# EAGLE design Blupill SCSI(i) (EAGLE 5.08)
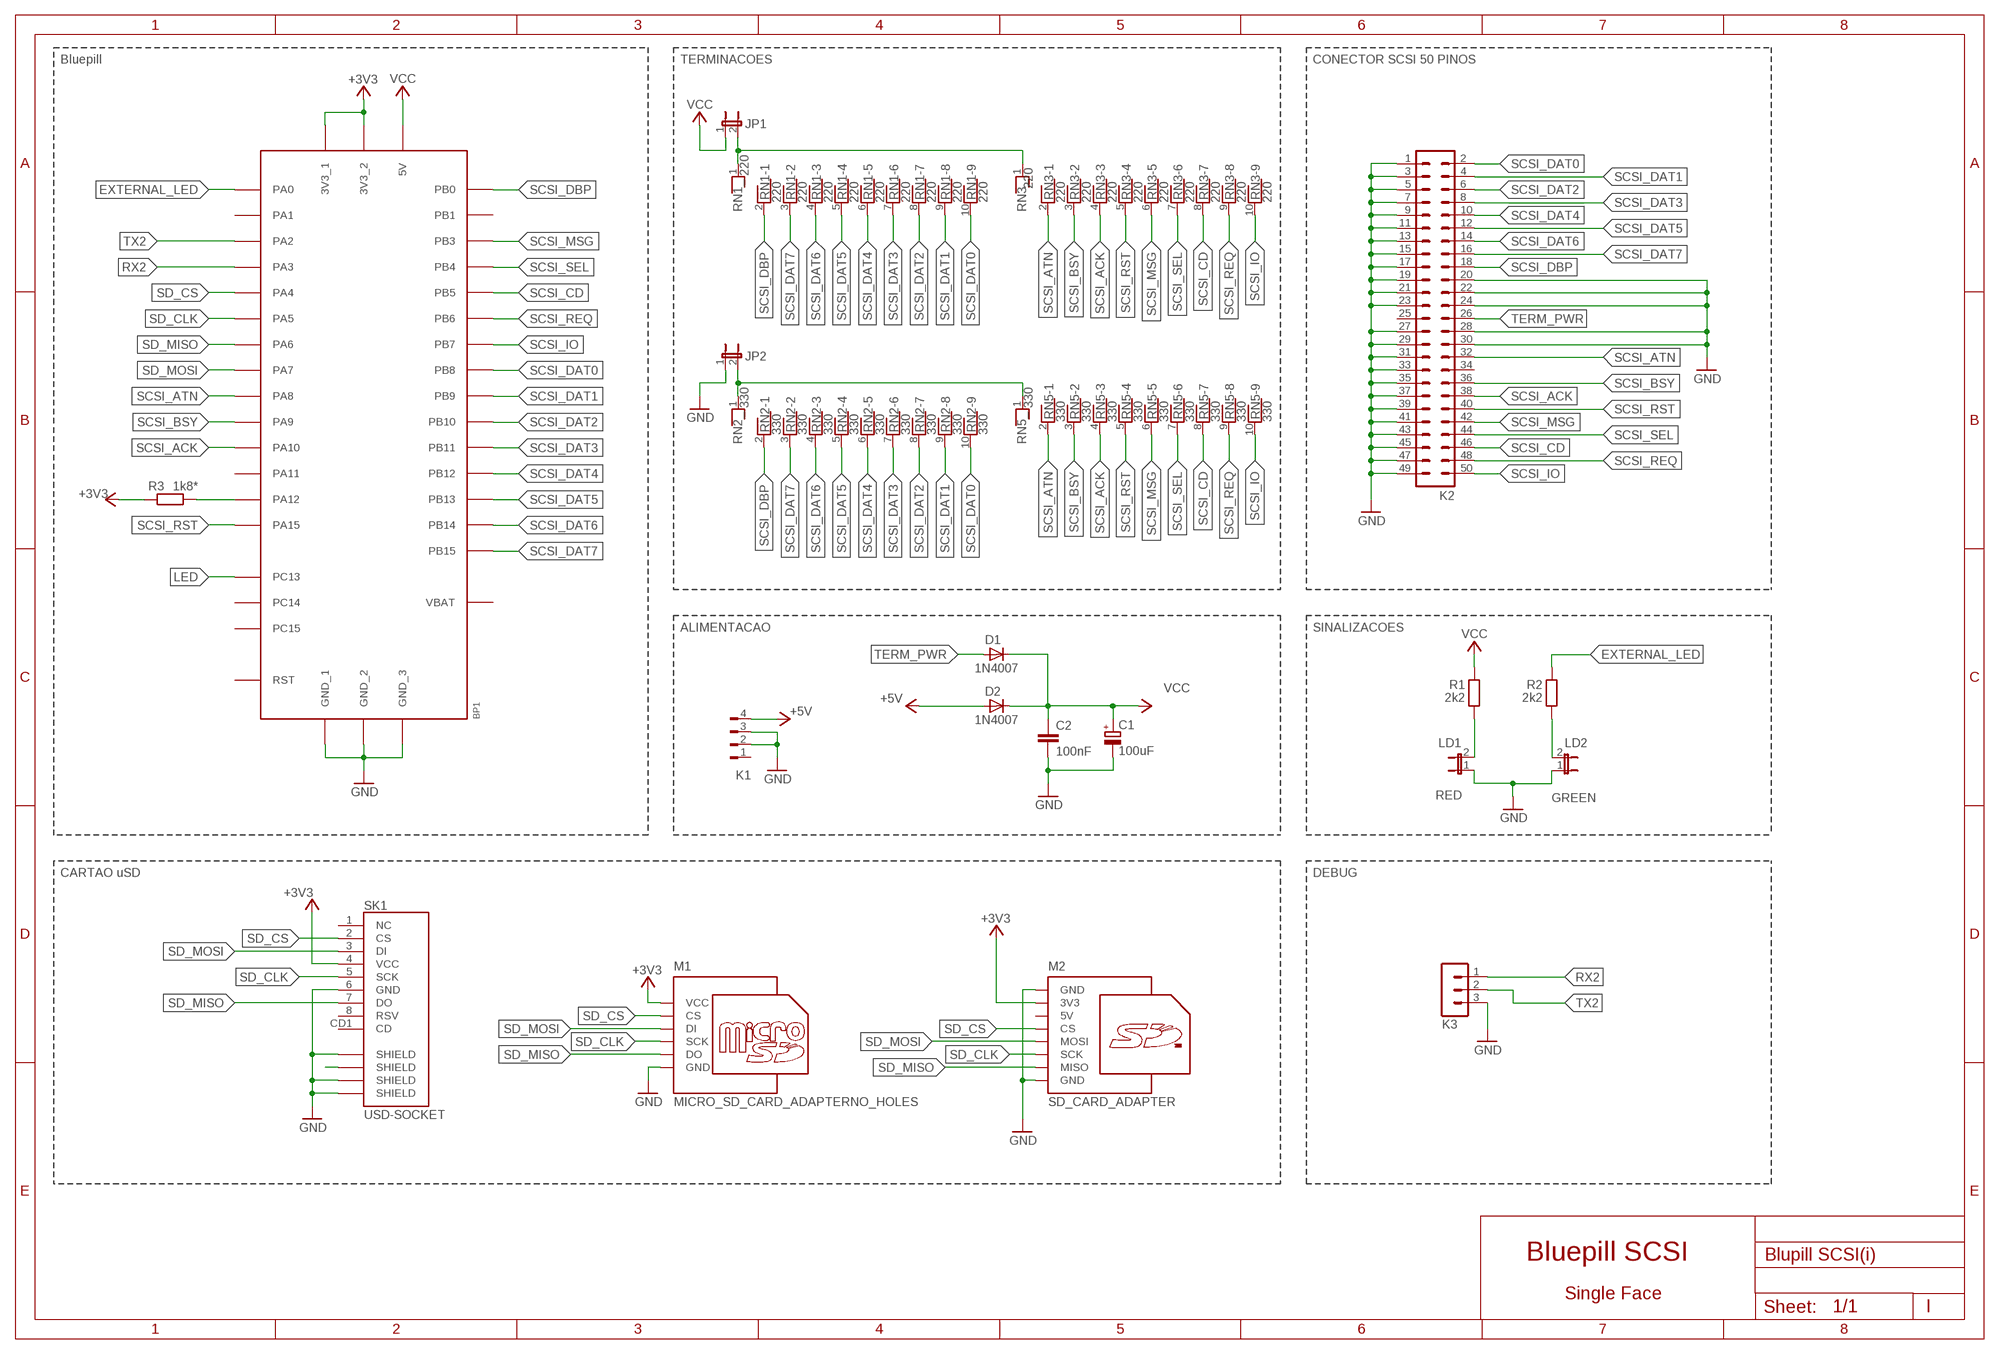
[diagram p0: schematic, sheet 1]

## Parts
BP1  BLUE_PILL_LONG  [BLUE_PILL_LONG]
C1  100uF  CPOL-EUE2.5-7  [E2,5-7]
C2  100nF  C-EU050-025X075  [C050-025X075]
D1  1N4007  1N4004  [DIODE_DO41-10]
D2  1N4007  1N4004  [DIODE_DO41-10]
JP1  JP1E  [JP1]
JP2  JP1E  [JP1]
K1  FLOP-4W827001  [827001]
K2  CON-HARTING-ML_ML50L_LONG  [HARTING-ML_ML50L_LONG]
K3  MA03-1  [MA03-1]
LD1  RED  JP1E  [JP1]
LD2  GREEN  JP1E  [JP1]
M1  MICRO_SD_CARD_ADAPTERNO_HOLES  [MICRO_SD-ADAPTER_NOHOLES]
M2  SD_CARD_ADAPTER  [SD/MMCADAPTER]
R1  2k2  R300_THT  [RCL_0204/7]
R2  2k2  R300_THT  [RCL_0204/7]
R3  1k8*  R300_THT  [RCL_0204/7]
RN1  220  RNX9  [RN-10]
RN2  330  RNX9  [RN-10]
RN3  220  RNX9  [RN-10]
RN5  330  RNX9  [RN-10]
SK1  USD-SOCKET  [USD-SOCKET-PP]

## Nets
+3V3: BP1.3,3V_1(3V3_1) BP1.3,3V_2(3V3_2) M1.P$1(VCC) M2.P$3(3V3) R3.1 SK1.4(VCC)
+5V: D2.A K1.4
EXTERNAL_LED: BP1.A0 R2.2
GND: BP1.GND1(GND_1) BP1.GND2(GND_2) BP1.GND3(GND_3) C1.- C2.2 JP2.1 K1.2 K1.3 K2.1 K2.3 K2.5 K2.7 K2.9 K2.11 K2.13 K2.15 K2.17 K2.19 K2.20 K2.21 K2.22 K2.23 K2.24 K2.27 K2.28 K2.29 K2.30 K2.31 K2.33 K2.35 K2.37 K2.39 K2.41 K2.43 K2.45 K2.47 K2.49 K3.3 LD1.1 LD2.1 M1.P$6(GND) M2.P$1(GND) M2.P$15(GND) SK1.6(GND) SK1.GND1(SHIELD) SK1.GND2(SHIELD) SK1.GND3(SHIELD)
LED: BP1.C13
N$1: JP2.2 RN2.1 RN5.1
N$2: LD1.2 R1.1
N$3: LD2.2 R2.1
N$4: JP1.2 RN1.1 RN3.1
N$5: BP1.A12 R3.2
RX2: BP1.A3 K3.1
SCSI_ACK: BP1.A10 K2.38 RN3.4 RN5.4
SCSI_ATN: BP1.A8 K2.32 RN3.2 RN5.2
SCSI_BSY: BP1.A9 K2.36 RN3.3 RN5.3
SCSI_CD: BP1.B5 K2.46 RN3.8 RN5.8
SCSI_DAT0: BP1.B8 K2.2 RN1.10 RN2.10
SCSI_DAT1: BP1.B9 K2.4 RN1.9 RN2.9
SCSI_DAT2: BP1.B10 K2.6 RN1.8 RN2.8
SCSI_DAT3: BP1.B11 K2.8 RN1.7 RN2.7
SCSI_DAT4: BP1.B12 K2.10 RN1.6 RN2.6
SCSI_DAT5: BP1.B13 K2.12 RN1.5 RN2.5
SCSI_DAT6: BP1.B14 K2.14 RN1.4 RN2.4
SCSI_DAT7: BP1.B15 K2.16 RN1.3 RN2.3
SCSI_DBP: BP1.B0 K2.18 RN1.2 RN2.2
SCSI_IO: BP1.B7 K2.50 RN3.10 RN5.10
SCSI_MSG: BP1.B3 K2.42 RN3.6 RN5.6
SCSI_REQ: BP1.B6 K2.48 RN3.9 RN5.9
SCSI_RST: BP1.A15 K2.40 RN3.5 RN5.5
SCSI_SEL: BP1.B4 K2.44 RN3.7 RN5.7
SD_CLK: BP1.A5 M1.P$4(SCK) M2.P$11(SCK) SK1.5(SCK)
SD_CS: BP1.A4 M1.P$2(CS) M2.P$7(CS) SK1.2(CS)
SD_MISO: BP1.A6 M1.P$5(DO) M2.P$13(MISO) SK1.7(DO)
SD_MOSI: BP1.A7 M1.P$3(DI) M2.P$9(MOSI) SK1.3(DI)
SH_FLOAT: SK1.GND4(SHIELD)
TERM_PWR: D1.A K2.26
TX2: BP1.A2 K3.2
VCC: BP1.5V C1.+ C2.1 D1.C D2.C JP1.1 R1.2
Unconnected: BP1.A1 BP1.A11 BP1.B1 BP1.C14 BP1.C15 BP1.RST K1.1 K2.25 K2.34 M2.P$5(5V) SK1.1(NC) SK1.8(RSV) SK1.CD1(CD)

## Notes on the sheet
- Bluepill | TERMINACOES | CONECTOR SCSI 50 PINOS
- ALIMENTACAO | SINALIZACOES
- CARTAO uSD | DEBUG
- Bluepill SCSI
- Single Face
- I

## Power pins joined to a net without a drawn wire
VBAT: BP1.VB(VBAT)

## Library data of the parts
BP1 = sd_adapters:BLUE_PILL: Módulo de desenvolvimento Blue Pill.
C1 = rcl:CPOL-EU: POLARIZED CAPACITOR, European symbol
C2 = rcl:C-EU: CAPACITOR, European symbol
D1 D2 = sd_adapters:1N4004
JP1 JP2 LD1 LD2 = jumper:JP1E: JUMPER
K1 = con-amp:FLOP-4W: MATE N-LOCK Floppy / HDD conector Distributor: Bürklin 71F972
K2 = sd_adapters:CON-HARTING-ML_ML50: HARTING
K3 = con-lstb:MA03-1: PIN HEADER
M1 = sd_adapters:MICRO_SD_CARD_ADAPTER
M2 = sd_adapters:SD_CARD_ADAPTER
R1-R3 = sd_adapters:R300_THT
RN1-RN3 RN5 = resistor-net:RNX9: RESISTOR NETWORK
SK1 = sd_adapters:USD-SOCKET: Footprint do soquete para cartão uSD.

## Board
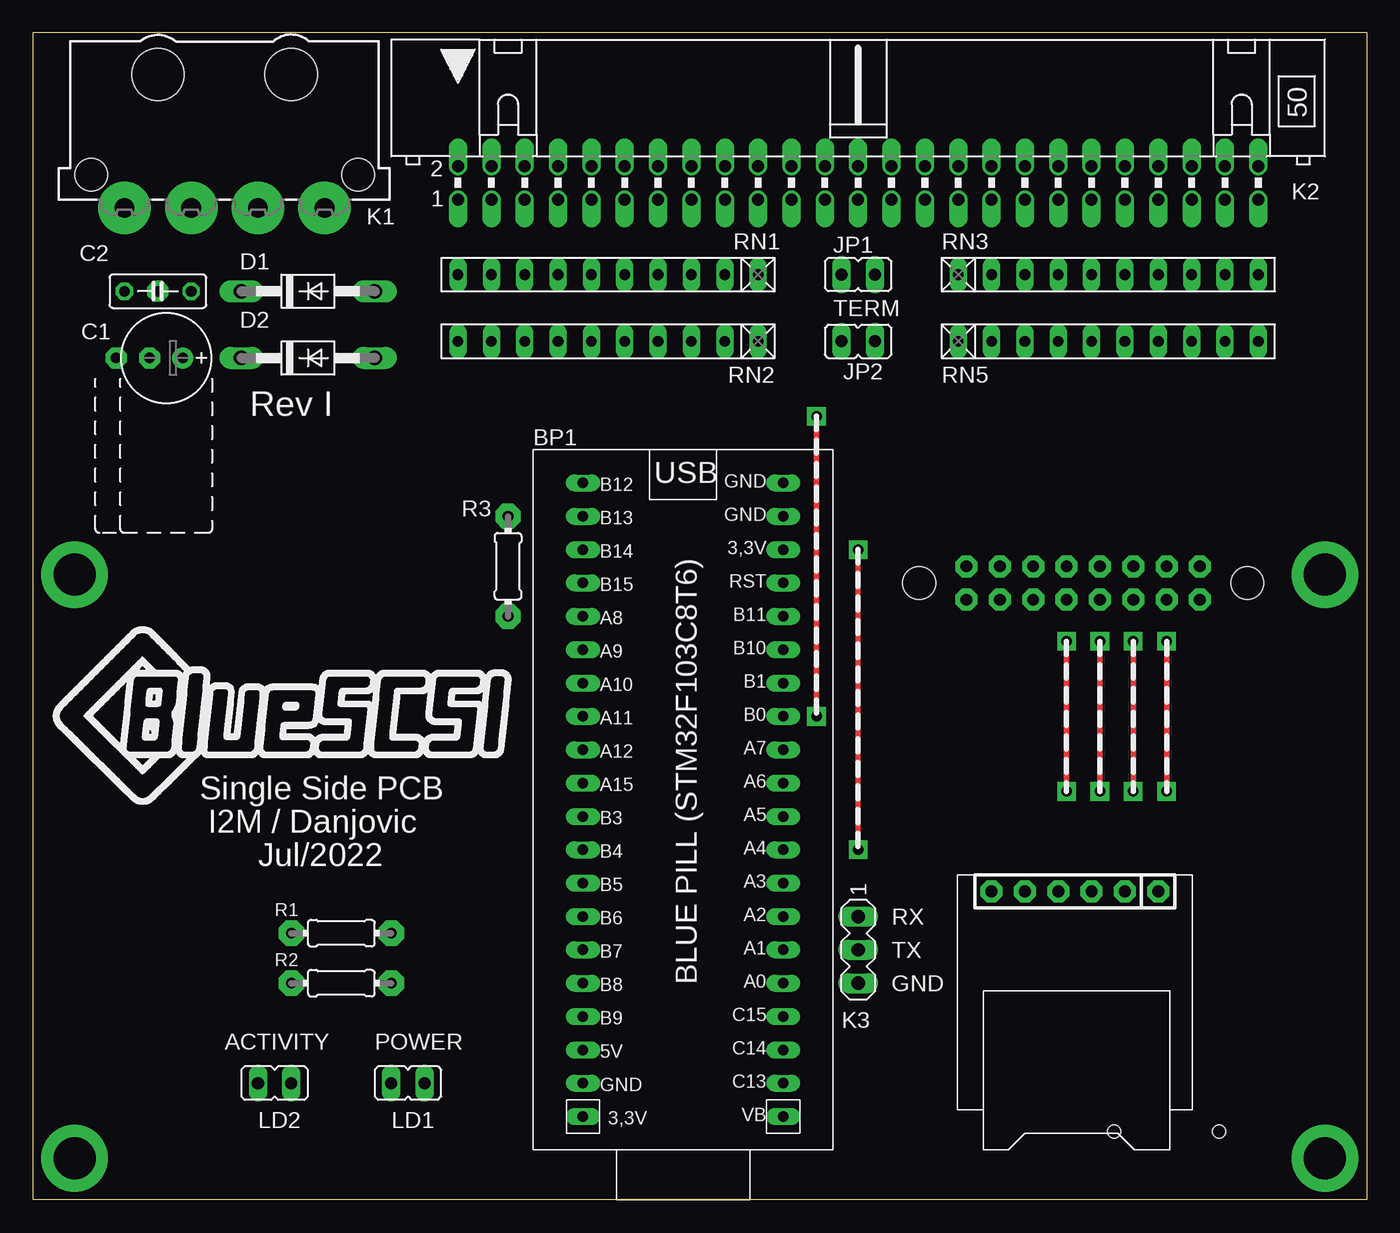
[diagram p1: board, top side]
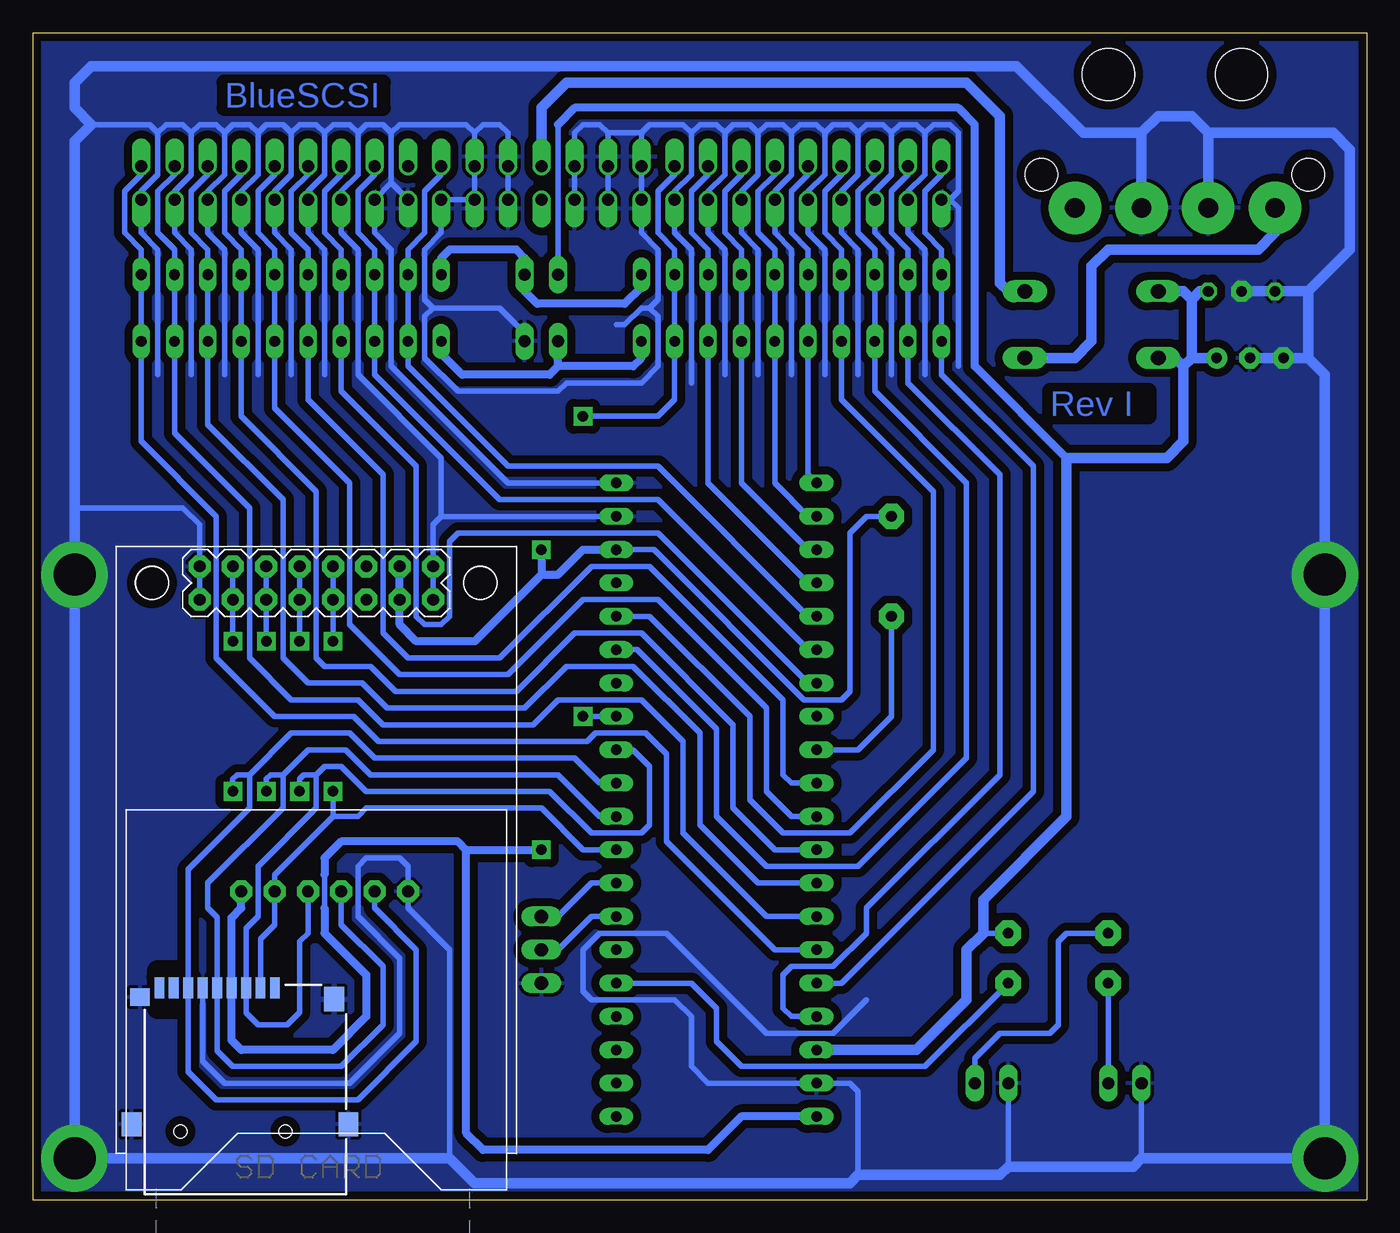
[diagram p2: board, bottom side, seen from below]

Size 101.6 x 88.9 mm. Coordinates in mm from the lower left corner, seen from the top.
Outline: 101.6,88.9 101.6,0 0,0 0,88.9 101.6,88.9
Copper layers (1*16): Top 0.035mm / dielectric 1.5mm / Bottom 0.035mm
Design rules "default *": minimum track width 16mil, minimum drill 24mil, track to track 8mil, track to pad 8mil, pad to pad 8mil, via to via 8mil, smd to smd 8mil, copper to edge 25mil, drill to drill 8mil, minimum pad ring 10mil, minimum via ring 8mil, stop-mask expansion 4mil, vias tented up to drill 0mil, thermal gap 10mil
bRestrict: 2 lines

### Footprints (pad centres in the part's own frame; a part is rotated, then mirrored left to right if it is on the bottom)
BLUE_PILL_LONG = drill 0.8 long: 3,3V_1 -19.05,7.62; 3,3V_2 24.13,-7.62; 5V 19.05,-7.62; A0 13.97,7.62; A1 11.43,7.62; A2 8.89,7.62; A3 6.35,7.62; A4 3.81,7.62; A5 1.27,7.62; A6 -1.27,7.62; A7 -3.81,7.62; A8 -13.97,-7.62; A9 -11.43,-7.62; A10 -8.89,-7.62; A11 -6.35,-7.62; A12 -3.81,-7.62; A15 -1.27,-7.62; B0 -6.35,7.62; B1 -8.89,7.62; B3 1.27,-7.62; B4 3.81,-7.62; B5 6.35,-7.62; B6 8.89,-7.62; B7 11.43,-7.62; B8 13.97,-7.62; B9 16.51,-7.62; B10 -11.43,7.62; B11 -13.97,7.62; B12 -24.13,-7.62; B13 -21.59,-7.62; B14 -19.05,-7.62; B15 -16.51,-7.62; C13 21.59,7.62; C14 19.05,7.62; C15 16.51,7.62; GND1 -24.13,7.62; GND2 -21.59,7.62; GND3 21.59,-7.62; RST -16.51,7.62; VB 24.13,7.62
E2,5-7 = drill 0.813 pad 1.6 round: + -1.27,0 | drill 0.813 pad 1.6 octagon: - 1.27,0
C050-025X075 = drill 0.813 octagon: 1 -2.54,0; 2 2.54,0
DIODE_DO41-10 = drill 1.118 long: A 5.08,0; C -5.08,0
JP1 = drill 0.914 long: 1 0,-1.27; 2 0,1.27
827001 = drill 1.5 pad 4 round: 1 -7.62,0; 2 -2.54,0; 3 2.54,0; 4 7.62,0 | hole 4: 5.08,-10.16; -5.08,-10.16 | hole 2.5: 10.16,-2.54; -10.16,-2.54
HARTING-ML_ML50L_LONG = drill 0.914 offset: 1 -30.48,-1.27; 2 -30.48,1.27; 3 -27.94,-1.27; 4 -27.94,1.27; 5 -25.4,-1.27; 6 -25.4,1.27; 7 -22.86,-1.27; 8 -22.86,1.27; 9 -20.32,-1.27; 10 -20.32,1.27; 11 -17.78,-1.27; 12 -17.78,1.27; 13 -15.24,-1.27; 14 -15.24,1.27; 15 -12.7,-1.27; 16 -12.7,1.27; 17 -10.16,-1.27; 18 -10.16,1.27; 19 -7.62,-1.27; 20 -7.62,1.27; 21 -5.08,-1.27; 22 -5.08,1.27; 23 -2.54,-1.27; 24 -2.54,1.27; 25 0,-1.27; 26 0,1.27; 27 2.54,-1.27; 28 2.54,1.27; 29 5.08,-1.27; 30 5.08,1.27; 31 7.62,-1.27; 32 7.62,1.27; 33 10.16,-1.27; 34 10.16,1.27; 35 12.7,-1.27; 36 12.7,1.27; 37 15.24,-1.27; 38 15.24,1.27; 39 17.78,-1.27; 40 17.78,1.27; 41 20.32,-1.27; 42 20.32,1.27; 43 22.86,-1.27; 44 22.86,1.27; 45 25.4,-1.27; 46 25.4,1.27; 47 27.94,-1.27; 48 27.94,1.27; 49 30.48,-1.27; 50 30.48,1.27
MA03-1 = drill 1.016 long: 1 -2.54,0; 2 0,0; 3 2.54,0
MICRO_SD-ADAPTER_NOHOLES = drill 0.9 pad 1.676 octagon: P$1 0,6.35; P$2 0,3.81; P$3 0,1.27; P$4 0,-1.27; P$5 0,-3.81; P$6 0,-6.35
SD/MMCADAPTER = drill 0.9 pad 1.676 octagon: P$1 -1.27,8.89; P$2 1.27,8.89; P$3 -1.27,6.35; P$4 1.27,6.35; P$5 -1.27,3.81; P$6 1.27,3.81; P$7 -1.27,1.27; P$8 1.27,1.27; P$9 -1.27,-1.27; P$10 1.27,-1.27; P$11 -1.27,-3.81; P$12 1.27,-3.81; P$13 -1.27,-6.35; P$14 1.27,-6.35; P$15 -1.27,-8.89; P$16 1.27,-8.89 | hole 2.5: 0,12.5; 0,-12.5
RCL_0204/7 = drill 0.813 pad 1.93 octagon: 1 -3.81,0; 2 3.81,0
RN-10 = drill 0.813 long: 1 -11.43,0; 2 -8.89,0; 3 -6.35,0; 4 -3.81,0; 5 -1.27,0; 6 1.27,0; 7 3.81,0; 8 6.35,0; 9 8.89,0; 10 11.43,0
USD-SOCKET-PP = smd 0.75 x 1.6: 1 1.93,7.91; 2 0.83,7.91; 3 -0.27,7.91; 4 -1.37,7.91; 5 -2.47,7.91; 6 -3.57,7.91; 7 -4.67,7.91; 8 -5.77,7.91; CD1 -6.87,7.91 | smd 1.5 x 1.35: GND1 -8.339,7.19 | smd 1.5 x 1.858: GND2 -8.974,-2.494; GND3 7.534,-2.494; GND4 6.434,7.04 | hole 1: 2.73,-3.04; -5.27,-3.04

### Placement (x,y rotation side)
BP1  49.53,30.48 270 top
C1  10.16,64.14 180 top
C2  9.52,69.22 180 top
D1  20.96,69.22 0 top
D2  20.96,64.14 0 top
JP1  62.86,70.48 270 top
JP2  62.86,65.41 90 top
K1  14.61,75.56 180 top
K2  62.86,77.47 0 top
K3  62.86,19.05 270 top
LD1  28.57,8.89 270 top
LD2  18.41,8.89 270 top
M1  79.38,23.5 270 top
M2  80.01,46.99 270 bottom
R1  23.5,20.32 0 top
R2  23.5,16.51 0 top
R3  36.2,48.26 270 top
RN1  43.81,70.48 180 top
RN2  43.81,65.41 180 top
RN3  81.91,70.48 0 top
RN5  81.91,65.41 0 top
SK1  85.09,8.25 0 bottom

### Tracks (layer width: path | path; a pad name or v marks a point on that pad's centre or on a via)
+3V3  (via drill 0.8 pad 1.42)
  Top 0.406: v62.86,26.67 v62.86,49.53
  Bottom 0.406: BP1.3,3V_1 54.29,49.53 42.86,38.1 40,38.1 39.37,38.73 39.37,50.8 38.1,52.07 R3.1 | 79.38,24.77 79.38,22.23
  Bottom 0.61: BP1.3,3V_2 47.62,6.35 50.16,3.81 67.31,3.81 68.58,5.08 68.58,26.67 | BP1.3,3V_1 59.69,49.53 61.59,47.62 62.86,47.62 | v62.86,49.53 62.86,47.62 | 62.86,47.62 67.94,42.54 72.39,42.54 73.66,43.81 M2.P$3 | M1.P$1 85.72,22.23 86.46,21.49 SK1.4 86.46,12.16 85.72,11.43 78.74,11.43 76.2,13.97 76.2,17.14 79.38,20.32 79.38,22.23 | 79.38,24.77 79.38,26.04 78.11,27.3 69.22,27.3 68.58,26.67 | 68.58,26.67 v62.86,26.67
+5V
  Bottom 0.813: D2.A 22.23,64.14 20.96,65.41 20.96,71.12 19.69,72.39 8.25,72.39 6.98,73.66 K1.4
EXTERNAL_LED
  Bottom 0.406: BP1.A0 51.43,16.51 49.53,14.61 49.53,12.07 47.62,10.16 33.66,10.16 R2.2
GND  (via drill 0.8 pad 1.6, 3.2 pad 5.08)
  Bottom 0.406: 92.08,81.28 92.08,78.11 93.34,76.83 K2.49 93.34,73.66 92.08,72.39 92.08,62.86 | 89.53,81.28 89.53,78.11 90.8,76.83 K2.47 90.8,73.66 89.53,72.39 89.53,62.86 | 86.99,81.28 86.99,78.11 88.27,76.83 K2.45 88.27,73.66 86.99,72.39 86.99,62.86 | 84.45,81.28 84.45,78.11 85.72,76.83 K2.43 85.72,73.66 84.45,72.39 84.45,62.86 | 81.91,81.28 81.91,78.11 83.19,76.83 K2.41 83.19,73.66 81.91,72.39 81.91,62.86 | 79.38,81.28 79.38,78.11 80.64,76.83 K2.39 80.64,73.66 79.38,72.39 79.38,62.86 | 76.83,81.28 76.83,78.11 78.11,76.83 K2.37 78.11,73.66 76.83,72.39 76.83,62.86 70.48,56.52 70.48,52.07 | 74.3,77.47 K2.35 75.56,73.66 74.3,72.39 74.3,63.5 65.41,54.61 BP1.GND1 | 74.3,81.28 74.3,77.47 | 74.3,77.47 K2.33 | K2.23 K2.24 60.32,81.28 59.69,81.91 58.42,81.91 57.78,81.28 | K2.21 K2.22 57.78,81.28 | K2.27 K2.28 65.41,81.28 66.04,81.91 67.31,81.91 67.94,81.28 | 67.94,81.28 K2.30 K2.29 K2.31 70.48,73.66 71.75,72.39 71.75,68.58 71.12,67.94 | 55.24,81.28 57.78,81.28 | 55.24,81.28 54.61,81.91 52.07,81.91 51.43,81.28 | 51.43,81.28 50.8,81.91 49.53,81.91 48.89,81.28 | 48.89,81.28 48.26,81.91 46.99,81.91 46.35,81.28 | 55.24,81.28 K2.20 K2.19 55.24,73.66 53.97,72.39 53.97,68.58 54.61,67.94 | 51.43,81.28 51.43,78.11 52.7,76.83 K2.17 52.7,73.66 51.43,72.39 51.43,62.23 | 48.89,81.28 48.89,78.11 50.16,76.83 K2.15 50.16,73.66 48.89,72.39 48.89,62.86 | 46.35,81.28 46.35,78.11 47.62,76.83 K2.13 47.62,73.66 46.35,72.39 46.35,62.86 | 43.81,81.28 43.81,78.11 45.08,76.83 K2.11 45.08,73.66 43.81,72.39 43.81,62.86 | 46.35,81.28 45.72,81.91 44.45,81.91 43.81,81.28 | 41.27,81.28 41.27,78.11 42.54,76.83 K2.9 42.54,73.66 41.27,72.39 41.27,62.86
  Bottom 0.406: 41.27,81.28 41.91,81.91 43.18,81.91 43.81,81.28 | 38.73,81.28 38.73,78.11 40,76.83 K2.7 40,73.66 38.73,72.39 38.73,62.86 | 41.27,81.28 40.64,81.91 39.37,81.91 38.73,81.28 | 36.2,81.28 36.2,78.11 37.46,76.83 K2.5 37.46,73.66 36.2,72.39 36.2,62.86 | 36.2,81.28 36.83,81.91 38.1,81.91 38.73,81.28 | 33.66,81.28 33.66,78.11 34.92,76.83 K2.3 34.92,73.66 33.66,72.39 33.66,62.86 | 36.2,81.28 35.56,81.91 34.29,81.91 33.66,81.28 | 31.75,76.2 K2.1 | 31.75,76.2 31.12,76.83 31.12,81.28 31.75,81.91 33.02,81.91 33.66,81.28 | 38.73,1.9 38.73,8.25 39.37,8.89 BP1.GND3 50.16,8.89 51.43,10.16 51.43,13.97 52.7,15.24 59.05,15.24 59.69,15.88 59.69,19.05 58.42,20.32 53.34,20.32 45.72,12.7 40.64,12.7 38.1,15.24 | 31.75,76.2 31.12,75.56 31.12,63.5 | 74.3,81.28 73.66,81.91 68.58,81.91 67.94,81.28 | 74.3,81.28 74.93,81.91 76.2,81.91 76.83,81.28 | 79.38,81.28 78.74,81.91 77.47,81.91 76.83,81.28 | 79.38,81.28 80.01,81.91 81.28,81.91 81.91,81.28 | 84.45,81.28 83.82,81.91 82.55,81.91 81.91,81.28 | 84.45,81.28 85.09,81.91 86.36,81.91 86.99,81.28 | 89.53,81.28 88.9,81.91 87.63,81.91 86.99,81.28 | 89.53,81.28 90.17,81.91 91.44,81.91 92.08,81.28 | 17.14,3.17 LD2.1 | 27.3,2.54 LD1.1 | 70.48,52.07 BP1.GND2 | 54.61,67.94 53.97,67.31 53.97,63.5 55.24,62.23 60.96,62.23 61.59,61.59 69.22,61.59 71.75,64.14 71.75,67.31 71.12,67.94 | 71.12,67.94 66.04,67.94 64.14,66.04 JP2.1 | 54.61,67.94 55.24,67.94 56.52,66.67 57.15,66.67 | 97.16,81.91 92.71,81.91 92.08,81.28 | 70.48,52.07 71.12,51.43 M2.P$1 71.12,45.72 | 98.42,52.7 90.17,52.7 88.9,51.43 M2.P$15 88.9,45.72 | 69.85,3.17 69.85,19.05 73.02,22.23 M1.P$6 73.02,25.4 73.66,26.04 76.2,26.04 76.83,25.4 76.83,21.59 73.66,18.41 73.66,12.7 77.47,8.89 86.99,8.89 88.66,10.55 SK1.6
  Bottom 0.813: 4.45,69.22 1.27,72.39 1.27,80.01 2.54,81.28 12.07,81.28 | 4.45,69.22 C2.2 v9.52,69.22 | C1.- v6.35,64.14 4.45,64.14 | 4.45,64.14 4.45,69.22 | 4.45,64.14 3.17,62.86 v3.17,47.62 v3.17,3.17 17.14,3.17 17.78,2.54 27.3,2.54 27.94,1.9 38.73,1.9 39.37,1.27 67.94,1.27 69.85,3.17 v98.42,3.17 v98.42,47.62 98.42,52.7 98.42,80.64 97.16,81.91 98.42,83.19 98.42,85.09 97.16,86.36 26.67,86.36 21.59,81.28 17.14,81.28 | 17.14,81.28 15.88,82.55 13.34,82.55 12.07,81.28 | 12.07,81.28 K1.3 | 17.14,81.28 K1.2
  pour Bottom (isolate 0.61): 101.6,0 0,0 0,88.9 101.6,88.9
N$1
  Bottom 0.61: RN5.1 70.48,64.45 68.9,62.86 62.23,62.86 61.59,63.5 | 61.59,63.5 55.88,63.5 55.24,64.14 RN2.1 | 61.59,63.5 JP2.2
N$2
  Bottom 0.406: LD1.2 29.85,10.79 27.94,12.7 24.13,12.7 23.5,13.34 23.5,19.69 22.86,20.32 R1.1
N$3
  Bottom 0.406: LD2.2 R2.1
N$4
  Bottom 0.61: RN3.1 70.48,71.75 69.85,72.39 64.77,72.39 64.14,71.75 JP1.2 64.14,69.22 63.18,68.26 56.52,68.26 55.24,69.53 RN1.1
N$5
  Bottom 0.406: BP1.A12 38.73,34.29 36.2,36.83 R3.2
RX2
  Bottom 0.406: BP1.A3 59.05,24.13 61.59,21.59 K3.1
SCSI_ACK
  Bottom 0.406: K2.38 78.11,78.11 79.38,76.83 79.38,73.66 78.11,72.39 RN3.4 RN5.4 78.11,61.59 72.39,55.88 72.39,44.45 71.75,43.81 70.48,43.81 69.85,44.45 69.85,50.16 69.22,50.8 53.97,50.8 42.54,39.37 BP1.A10
SCSI_ATN
  Bottom 0.406: BP1.A8 42.54,44.45 53.97,55.88 65.41,55.88 73.02,63.5 RN5.2 RN3.2 73.02,72.39 71.75,73.66 71.75,76.83 70.48,78.11 K2.32
SCSI_BSY
  Bottom 0.406: BP1.A9 42.54,41.91 53.97,53.34 66.04,53.34 75.56,62.86 RN5.3 RN3.3 75.56,72.39 76.83,73.66 76.83,76.83 75.56,78.11 K2.36
SCSI_CD
  Bottom 0.406: BP1.B5 46.35,24.13 50.8,28.57 50.8,35.56 55.88,40.64 60.96,40.64 64.14,37.46 74.61,37.46 76.52,39.37 80.64,39.37 82.55,41.27 82.55,53.34 88.27,59.05 RN5.8 RN3.8 88.27,72.39 89.53,73.66 89.53,76.83 88.27,78.11 K2.46
SCSI_DAT0
  Bottom 0.406: BP1.B8 40,16.51 25.4,31.12 25.4,55.88 32.38,62.86 RN2.10 RN1.10 32.38,72.39 33.66,73.66 33.66,76.83 32.38,78.11 K2.2
SCSI_DAT1
  Bottom 0.406: BP1.B9 43.81,13.97 44.45,14.61 44.45,17.14 43.81,17.78 40.64,17.78 38.1,20.32 38.1,22.23 27.94,32.38 27.94,55.24 34.92,62.23 RN2.9 RN1.9 34.92,72.39 36.2,73.66 36.2,76.83 34.92,78.11 K2.4
SCSI_DAT2
  Bottom 0.406: BP1.B10 55.56,41.91 49.53,35.88 49.53,29.21 45.72,25.4 38.73,25.4 30.48,33.66 30.48,54.61 37.46,61.59 RN2.8 RN1.8 37.46,72.39 38.73,73.66 38.73,76.83 37.46,78.11 K2.6
SCSI_DAT3
  Bottom 0.406: K2.8 40,78.11 41.27,76.83 41.27,73.66 40,72.39 RN1.7 RN2.7 40,60.96 33.02,53.97 33.02,34.29 39.37,27.94 44.45,27.94 46.99,30.48 46.99,36.83 54.61,44.45 BP1.B11
SCSI_DAT4
  Bottom 0.406: BP1.B12 42.54,55.24 RN2.6 RN1.6 42.54,72.39 43.81,73.66 43.81,76.83 42.54,78.11 K2.10
SCSI_DAT5
  Bottom 0.406: BP1.B13 42.54,52.07 45.08,54.61 RN2.5 RN1.5 45.08,72.39 46.35,73.66 46.35,76.83 45.08,78.11 K2.12
SCSI_DAT6
  Bottom 0.406: BP1.B14 42.54,49.53 47.62,54.61 RN2.4 RN1.4 47.62,72.39 48.89,73.66 48.89,76.83 47.62,78.11 K2.14
SCSI_DAT7
  Bottom 0.406: BP1.B15 42.54,46.99 50.16,54.61 RN2.3 RN1.3 50.16,72.39 51.43,73.66 51.43,76.83 50.16,78.11 K2.16
SCSI_DBP  (via drill 0.8 pad 1.42)
  Top 0.406: v59.69,36.83 v59.69,59.69
  Bottom 0.406: BP1.B0 v59.69,36.83 | K2.18 52.7,78.11 53.97,76.83 53.97,73.66 52.7,72.39 RN1.2 RN2.2 52.7,60.96 53.97,59.69 v59.69,59.69
SCSI_IO
  Bottom 0.406: BP1.B7 45.08,19.05 53.34,27.3 53.34,33.97 54.93,35.56 58.74,35.56 59.37,34.92 75.25,34.92 77.15,36.83 83.19,36.83 87.63,41.27 87.63,52.07 93.34,57.78 RN5.10 RN3.10 93.34,72.39 94.61,73.66 94.61,76.83 93.34,78.11 K2.50
SCSI_MSG
  Bottom 0.406: BP1.B3 43.81,29.21 45.72,31.12 45.72,37.46 53.97,45.72 59.69,45.72 65.41,40 73.66,40 77.47,43.81 77.47,54.61 83.19,60.32 RN5.6 RN3.6 83.19,72.39 84.45,73.66 84.45,76.83 83.19,78.11 K2.42
SCSI_REQ
  Bottom 0.406: BP1.B6 45.72,21.59 52.07,27.94 52.07,34.92 55.24,38.1 61.59,38.1 63.5,36.2 74.93,36.2 76.83,38.1 81.91,38.1 85.09,41.27 85.09,52.7 90.8,58.42 RN5.9 RN3.9 90.8,72.39 92.08,73.66 92.08,76.83 90.8,78.11 K2.48
SCSI_RST
  Bottom 0.406: BP1.A15 43.81,31.75 44.45,32.38 44.45,38.1 54.61,48.26 59.05,48.26 66.04,41.27 73.02,41.27 74.93,43.18 74.93,55.24 80.64,60.96 RN5.5 RN3.5 80.64,72.39 81.91,73.66 81.91,76.83 80.64,78.11 K2.40
SCSI_SEL
  Bottom 0.406: BP1.B4 45.08,26.67 48.26,29.85 48.26,36.2 55.24,43.18 60.32,43.18 64.77,38.73 73.98,38.73 75.88,40.64 79.38,40.64 80.01,41.27 80.01,53.97 85.72,59.69 RN5.7 RN3.7 85.72,72.39 86.99,73.66 86.99,76.83 85.72,78.11 K2.44
SD_CLK  (via drill 0.8 pad 1.42)
  Top 0.406: v83.82,31.12 v83.82,42.54
  Bottom 0.406: BP1.A5 58.42,29.21 61.59,32.38 75.88,32.38 77.79,34.29 80.64,34.29 82.55,32.38 | 82.55,32.38 83.5,32.38 83.82,32.07 v83.82,31.12 | v83.82,42.54 M2.P$11 | M1.P$4 78.11,20.96 74.93,17.78 74.93,13.34 78.11,10.16 86.36,10.16 87.56,11.36 SK1.5 87.56,21.52 88.27,22.23 88.27,24.13 82.55,29.85 82.55,32.38
SD_CS  (via drill 0.8 pad 1.42)
  Top 0.406: v78.74,31.12 v78.74,42.54
  Bottom 0.406: BP1.A4 59.69,26.67 62.86,29.85 76.2,29.85 76.83,29.21 78.74,29.21 | 78.74,29.21 v78.74,31.12 | v78.74,42.54 M2.P$7 | 78.74,29.21 83.19,24.77 M1.P$2 83.19,20.96 84.26,19.88 SK1.2
SD_MISO  (via drill 0.8 pad 1.42)
  Top 0.406: v86.36,31.12 v86.36,42.54
  Bottom 0.406: BP1.A6 58.42,31.75 60.32,33.66 75.56,33.66 77.47,35.56 81.91,35.56 85.09,32.38 | v86.36,42.54 M2.P$13 | 85.09,32.38 86.04,32.38 86.36,32.07 v86.36,31.12 | M1.P$5 75.56,22.23 72.39,19.05 72.39,12.07 76.83,7.62 87.63,7.62 89.76,9.75 SK1.7 89.76,25.18 85.09,29.85 85.09,32.38
SD_MOSI  (via drill 0.8 pad 1.42)
  Top 0.406: v81.28,31.12 v81.28,42.54
  Bottom 0.406: BP1.A7 55.88,34.29 54.61,33.02 54.61,28.57 55.24,27.94 59.05,27.94 62.23,31.12 76.2,31.12 78.11,33.02 79.38,33.02 80.01,32.38 | 80.01,32.38 80.96,32.38 81.28,32.07 v81.28,31.12 | v81.28,42.54 M2.P$9 | M1.P$3 80.64,20.32 81.28,19.69 81.28,14.29 82.23,13.34 84.45,13.34 85.36,14.24 SK1.3 85.36,20.69 84.45,21.59 84.45,25.4 80.01,29.85 80.01,32.38
SH_FLOAT
  pour Bottom (isolate 0.61): 76.83,17.14 80.01,20.32 80.64,19.69 80.64,14.61 83.19,12.07 78.74,12.07 76.83,13.97
TERM_PWR
  Bottom 0.813: D1.A 27.3,69.22 27.94,69.85 27.94,82.55 30.48,85.09 60.96,85.09 62.86,83.19 K2.26
TX2
  Bottom 0.406: BP1.A2 59.05,21.59 61.59,19.05 K3.2
VCC
  Bottom 0.406: 61.59,81.91 JP1.1 | 29.21,20.32 R1.2
  Bottom 0.61: 61.59,81.91 60.32,83.19 31.12,83.19 29.85,81.91 29.85,63.5 22.86,56.52
  Bottom 0.813: BP1.5V 34.29,11.43 30.48,15.24 30.48,19.05 29.21,20.32 29.21,22.86 22.86,29.21 22.86,56.52 15.24,56.52 13.97,57.78 13.97,63.5 | 13.97,63.5 14.61,64.14 D2.C | 13.34,64.14 C1.+ | 13.97,63.5 13.34,64.14 | 13.34,64.14 13.34,68.58 | 13.34,68.58 12.7,69.22 C2.1 | 13.34,68.58 13.97,69.22 D1.C

### Text on the board
Bottom: BlueSCSI | Rev I
tPlace: TERM | Rev I | Single Side PCB | I2M / Danjovic | Jul/2022 | RX | TX | GND | ACTIVITY | POWER